# Altium schematic sheet Cal.SchDoc: Relai MOSFET Controller
size A4; DrawnBy: Michael Watzek; Organization: HTL Hollabrunn; Address1: Abteilung Elektronik; Address2: Anton Ehrenfried-Straße 10; Address3: 2020 Hollabrunn; DocumentNumber: 12; Revision: 01; SheetNumber: 12; SheetTotal: 12
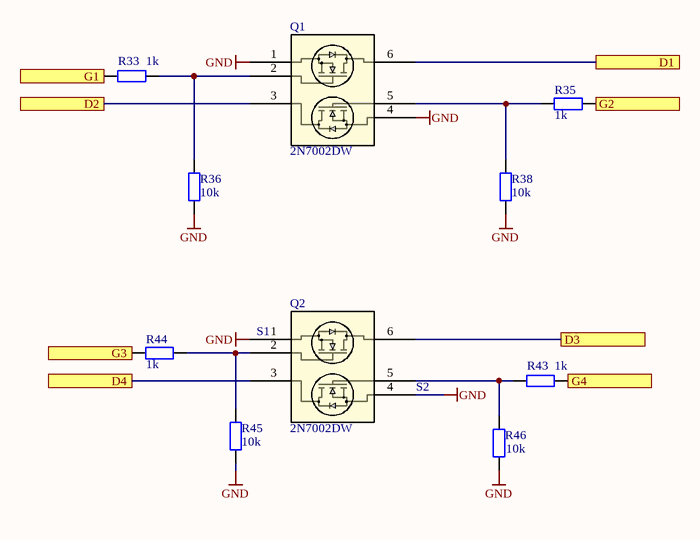
[diagram p0: Cal.SchDoc]

## Parts
Q1  2N7002DW  [SC-88SC70-6SOT-363_419B-02_ONS_OSI]
Q2  2N7002DW  [SC-88SC70-6SOT-363_419B-02_ONS_OSI]
R33  1k  [C1206-KUE]
R35  1k  [C1206-KUE]
R36  10k  [C1206-KUE]
R38  10k  [C1206-KUE]
R43  1k  [C1206-KUE]
R44  1k  [C1206-KUE]
R45  10k  [C1206-KUE]
R46  10k  [C1206-KUE]

## Ports
D1, D2, D3, D4, G1, G2, G3, G4

## Nets
GND: Q1.1 Q1.4 Q2.1 Q2.4 R36.2 R38.2 R45.2 R46.2
D1: Q1.6 ; port D1
D2: Q1.3 ; port D2
D3: Q2.6 ; port D3
D4: Q2.3 ; port D4
G1: R33.2 ; port G1
G2: R35.2 ; port G2
G3: R44.2 ; port G3
G4: R43.1 ; port G4
NetQ1_2: Q1.2 R33.1 R36.1
NetQ1_5: Q1.5 R35.1 R38.1
NetQ2_2: Q2.2 R44.1 R45.1
NetQ2_5: Q2.5 R43.2 R46.1

## Notes on the sheet
- (near Q2) S1
- (near Q2) S2
- Title
- Size:
- Date:
- A4
- Number:
- Time:
- Revision:
- Sheet
- of
- HTL Hollabrunn
- Abteilung Elektronik
- Anton Ehrenfried-Straße 10
- 2020 Hollabrunn
- File:
- Drawn By:

## Library data of the parts
Q1 Q2 = 2N7002DW: Description; Manufacturer_Name: onsemi; Copyright: Copyright (C) 2026 Ultra Librarian. All rights reserved.; Manufacturer_Part_Number: 2N7002DW; RefDes: RefDes; Type: Type
R33 R35 R36 R38 R43-R46 = ResistorSMD: Resistor SMD; Manufacturer: AVX; Bezeichnung: SMD Wid. 1/8W 2%; Published: 8-Jun-2000; LatestRevisionDate: 17-Jul-2002; LatestRevisionNote: Re-released for DXP Platform.; PackageReference: AXIAL-0.4; Publisher: Altium Limited; PackageDescription: Axial Device, Thru-Hole; 2 Leads; 0.4 in Pin Spacing; Orderingcode: *
  R33 R35 R43 R44: Value: 1k
  R36 R38 R45 R46: Value: 10k